# Altium schematic sheet signal_conditioning_sims2.SchDoc: Signal conditioning simulations. 2 of 2
size A4; SheetNumber: 18; SheetTotal: 21; TitleBig: Signal conditioning circuit simulations; Desc_line1: SPICE simulations of the adequation circuit. These are only the results. You can find the simulation circuit and models; Desc_line2: on the ./SIMULATIONS/ folder inside this project.
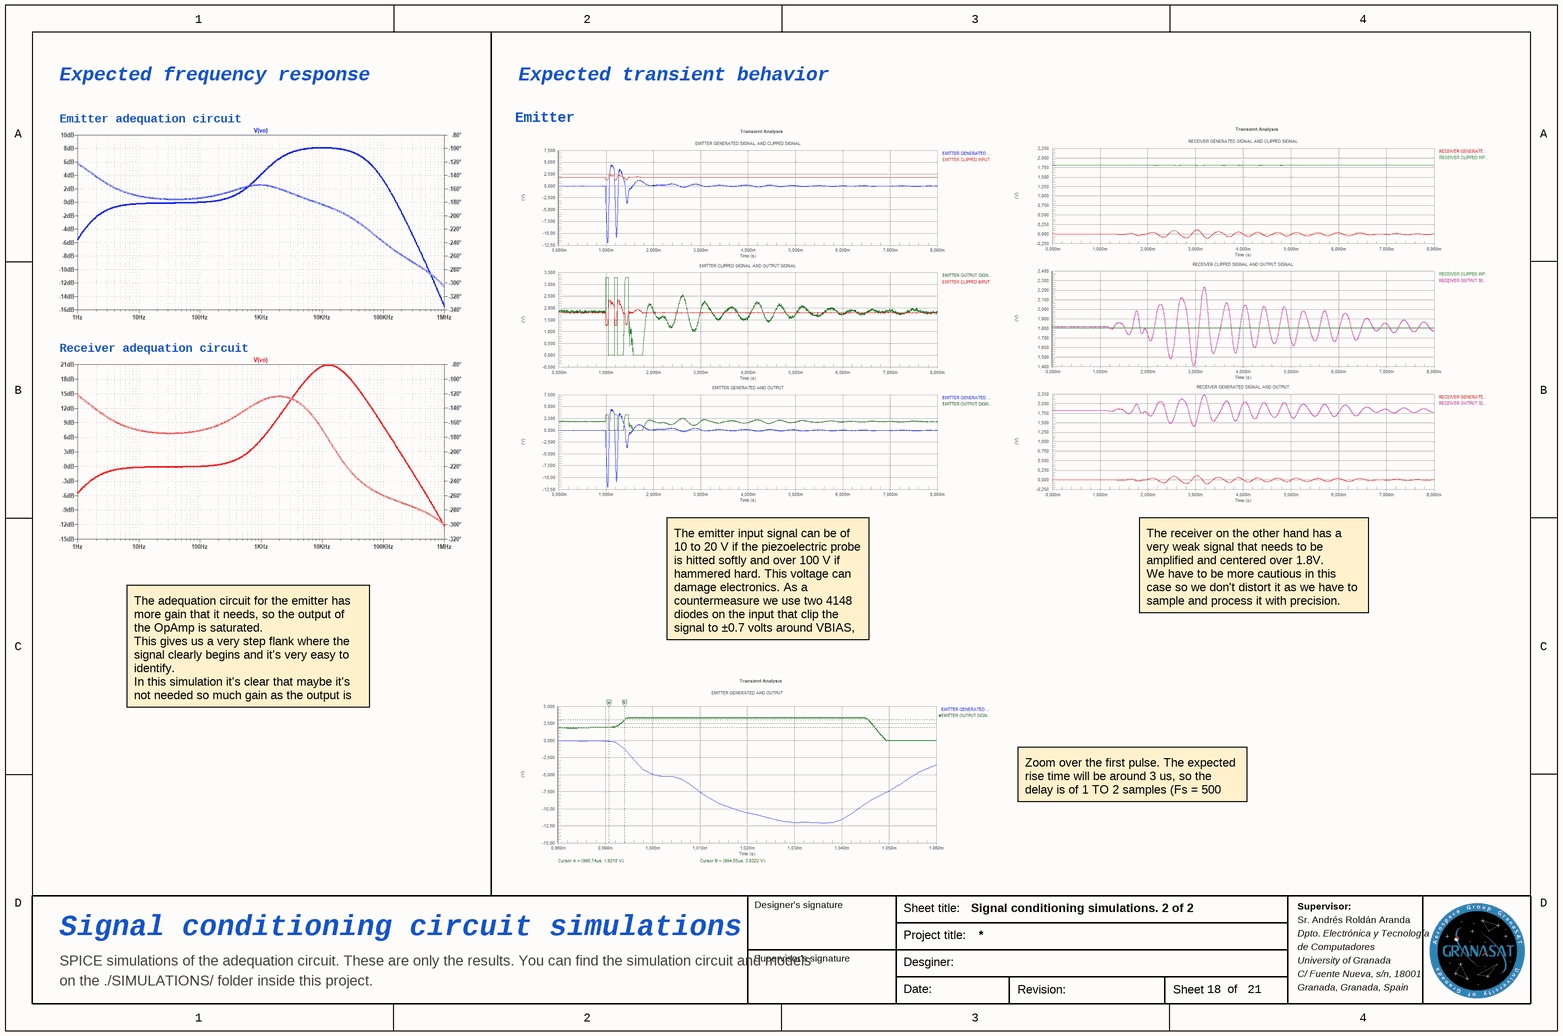
[diagram p0: signal_conditioning_sims2.SchDoc]

## Notes on the sheet
- Expected frequency response
- Expected transient behavior
- Emitter adequation circuit
- Emitter
- Receiver adequation circuit
- The emitter input signal can be of 10 to 20 V if the piezoelectric probe is hitted softly and over 100 V if hammered hard. This voltage can damage electronics. As a countermeasure we use two 4148 diodes on the input that clip the signal to ±0.7 volts around VBIAS, allowing us to manipulate it without risk.
- The receiver on the other hand has a very weak signal that needs to be amplified and centered over 1.8V.
  We have to be more cautious in this case so we don't distort it as we have to sample and process it with precision.
- The adequation circuit for the emitter has more gain that it needs, so the output of the OpAmp is saturated.
  This gives us a very step flank where the signal clearly begins and it's very easy to identify.
  In this simulation it's clear that maybe it's not needed so much gain as the output is very noisy and could be easily false-triggered.
- Zoom over the first pulse. The expected rise time will be around 3 us, so the delay is of 1 TO 2 samples (Fs = 500 kHz)
- Designer's signature
- Sheet title:
- Sr. Andrés Roldán Aranda
- Supervisor:
- Supervisor's signature
- Project title:
- Desginer:
- Dpto. Electrónica y Tecnología
- de Computadores
- University of Granada
- C/ Fuente Nueva, s/n, 18001
- Granada, Granada, Spain
- Date:
- Revision:
- Sheet
- of